# EAGLE design 5VPower (EAGLE 9.6.2)
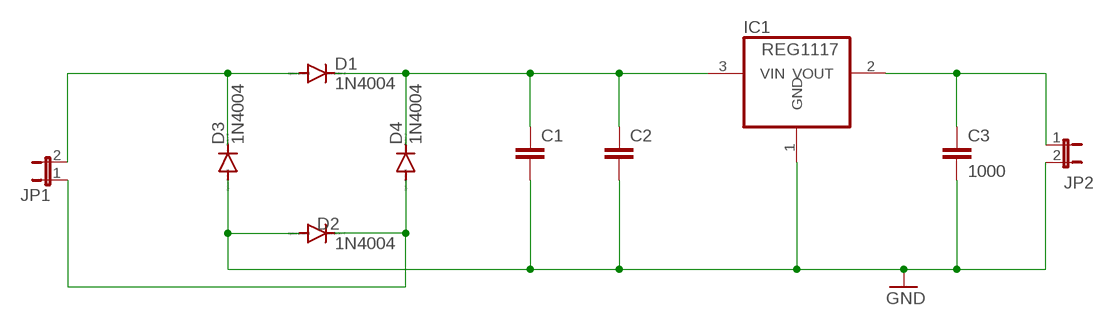
[diagram p0: schematic, sheet 1]

## Parts
C1  C2,5-3  [C2.5-3]
C2  C2,5-3  [C2.5-3]
C3  1000  C2,5-3  [C2.5-3]
D1  1N4004  [DO41-10]
D2  1N4004  [DO41-10]
D3  1N4004  [DO41-10]
D4  1N4004  [DO41-10]
IC1  REG1117  [SOT223]
JP1  JP1E  [JP1]
JP2  JP1E  [JP1]

## Nets
GND: C1.2 C2.2 C3.2 D2.A D3.A IC1.1(GND) JP2.2
N$1: D1.A D3.C JP1.2
N$3: D2.C D4.A JP1.1
N$4: C1.1 C2.1 D1.C D4.C IC1.3(VIN)
N$5: C3.1 IC1.2(VOUT) JP2.1

## Library data of the parts
C1-C3 = capacitor-wima:C: CAPACITOR naming: grid - package width
D1-D4 = diode:1N4004: DIODE general purpose rectifier, 1 A
IC1 = burr-brown:REG1117: 800mA and 1A Low Dropout (LDO) Positive Regulator 1.8V, 2.5V, 2.85V, 3.3V, 5V, and Adj; MPN: REG1117; OC_FARNELL: 1097566; OC_NEWARK: 14P6981
JP1 JP2 = jumper:JP1E: JUMPER

## Board
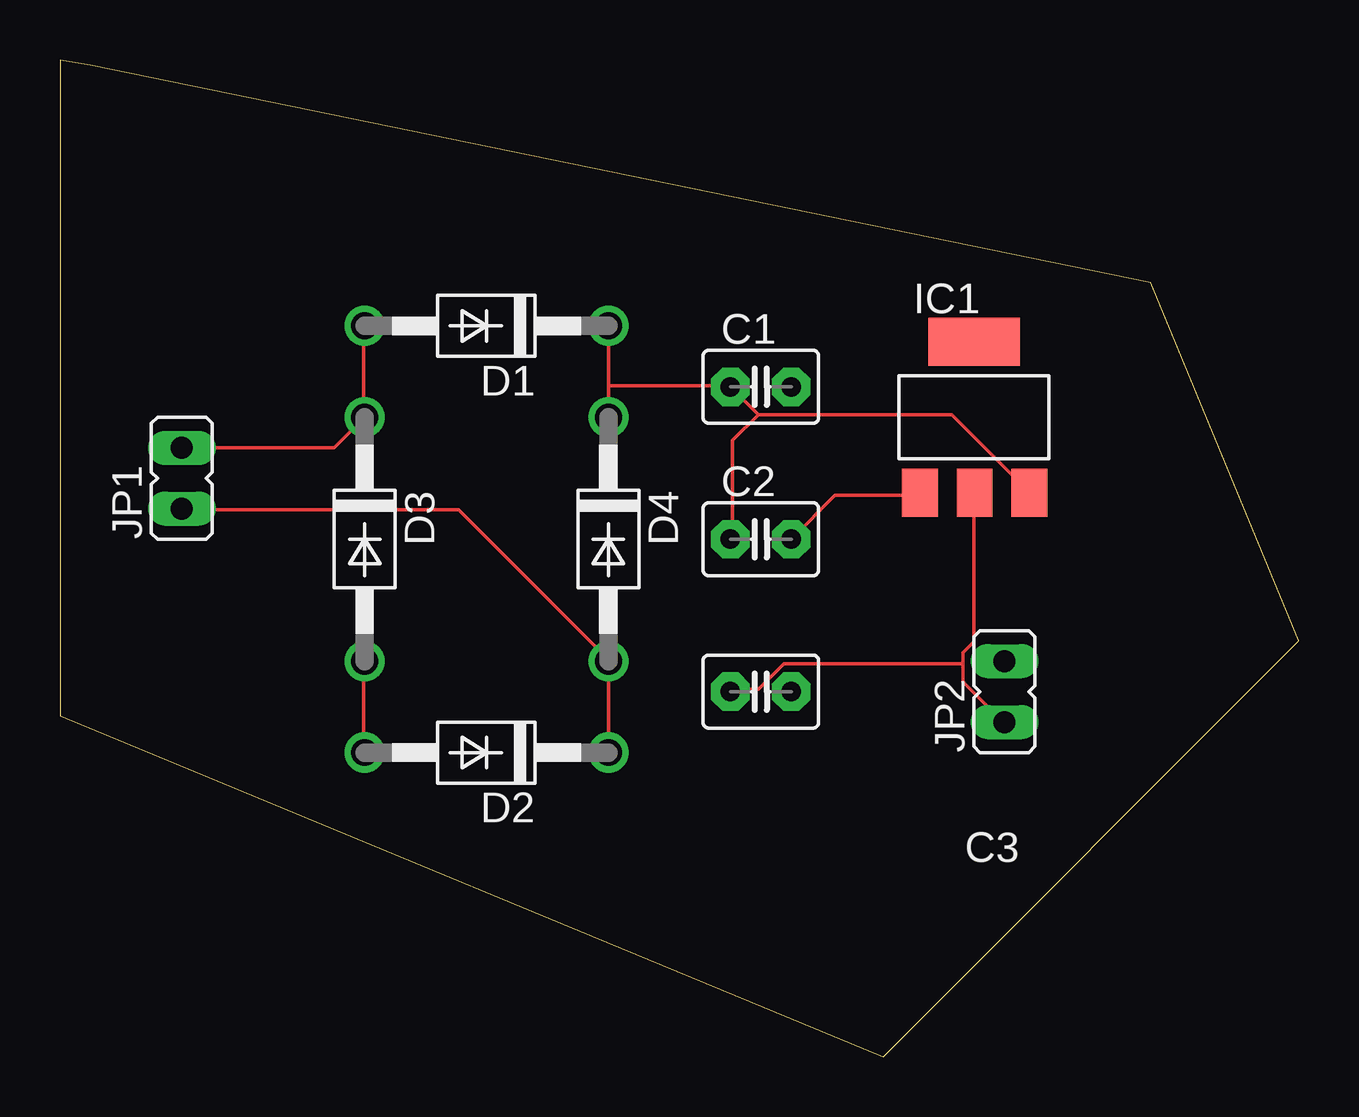
[diagram p1: board, top side]
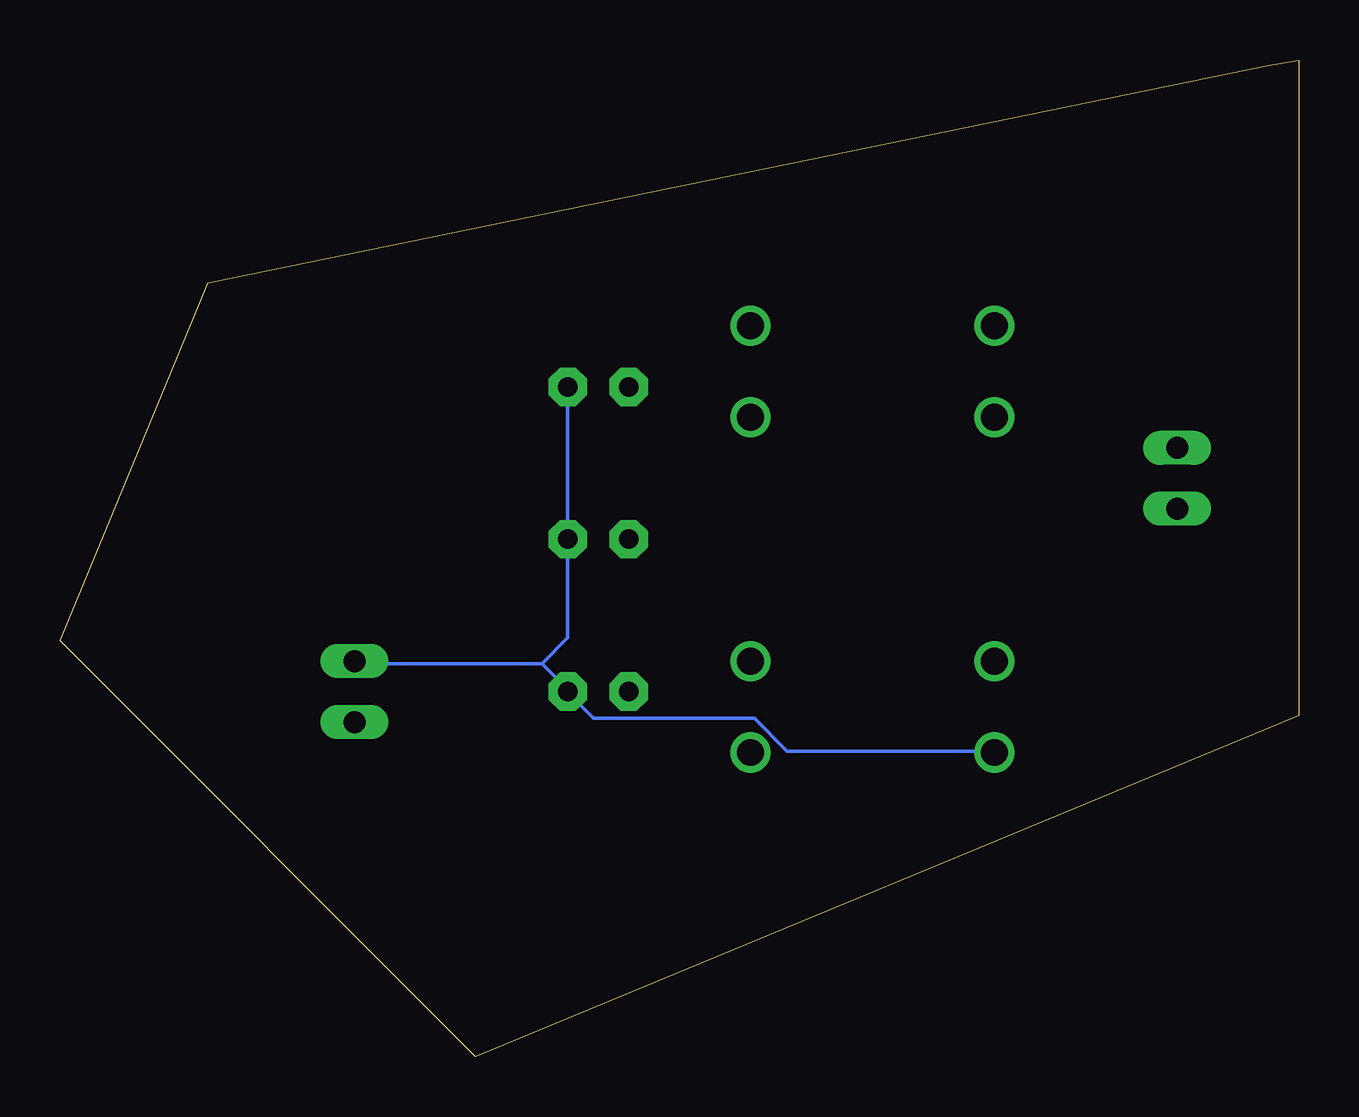
[diagram p2: board, bottom side, seen from below]

Size 51.65 x 41.53 mm. Coordinates in mm from the lower left corner, seen from the top.
Outline: 0,41.53 0,41.53
Outline: 0,41.53 0,14.21 34.32,0 51.65,17.33 45.46,32.26
Outline: 45.46,32.26 45.46,32.26
Outline: 45.46,32.26 45.46,32.26
Outline: 45.46,32.26 1.27,41.32 0,41.53
Outline: 0,41.53 0,41.53
Copper layers (1*16): Top 0.035mm / dielectric 1.5mm / Bottom 0.035mm
Design rules "default": minimum track width 6mil, minimum drill 0.35mm, track to track 6mil, track to pad 6mil, pad to pad 6mil, via to via 6mil, smd to smd 6mil, copper to edge 40mil, drill to drill 6mil, minimum pad ring 10mil, minimum via ring 8mil, stop-mask expansion 4mil, vias tented up to drill 0mil, thermal gap 10mil

### Footprints (pad centres in the part's own frame; a part is rotated, then mirrored left to right if it is on the bottom)
C2.5-3 = drill 0.813 pad 1.6 octagon: 1 -1.27,0; 2 1.27,0
DO41-10 = drill 1.118: A 5.08,0; C -5.08,0
SOT223 = smd 1.499 x 2.007: 1 -2.261,-3.15; 2 0.025,-3.15; 3 2.311,-3.15 | smd 3.81 x 2.007: 4 0,3.15
JP1 = drill 0.914 long: 1 0,-1.27; 2 0,1.27

### Placement (x,y rotation side)
C1  29.21,27.91 0 top
C2  29.21,21.56 0 top
C3  29.21,15.21 0 top
D1  17.78,30.45 180 top
D2  17.78,12.67 180 top
D3  12.7,21.56 270 top
D4  22.86,21.56 270 top
IC1  38.1,26.64 0 top
JP1  5.08,24.1 0 top
JP2  39.37,15.21 0 top

### Tracks (layer width: path | path; a pad name or v marks a point on that pad's centre or on a via)
GND
  Top 0.152: C2.2 32.31,23.39 35.81,23.39 IC1.1 | D2.A 12.65,12.72 12.65,16.38 D3.A
  Bottom 0.152: C1.2 C2.2 30.48,17.45 31.55,16.38 | 31.55,16.38 39.32,16.38 JP2.2 | 31.55,16.38 30.48,15.32 C3.2 30.48,15.16 29.41,14.1 22.71,14.1 21.34,12.72 12.8,12.72 D2.A
N$1
  Top 0.152: JP1.2 11.43,25.37 D3.C 12.65,26.75 12.65,30.4 D1.A
N$3
  Top 0.152: JP1.1 5.18,22.78 16.61,22.78 22.86,16.53 D4.A D2.C
N$4
  Top 0.152: D1.C 22.86,27.96 | 22.86,27.96 D4.C | 29.11,26.75 37.19,26.75 40.39,23.54 IC1.3 | 29.11,26.75 C1.1 27.89,27.96 22.86,27.96 | 29.11,26.75 28.04,25.68 28.04,21.56 C2.1
N$5
  Top 0.152: 37.64,16.38 37.64,15.62 39.32,13.94 JP2.1 | 37.64,16.38 37.64,16.84 38.1,17.3 38.1,23.39 IC1.2 | 37.64,16.38 30.18,16.38 29.11,15.32 28.04,15.32 C3.1